# Altium schematic sheet Main.SchDoc
size A2; SheetNumber: 1; SheetTotal: 5
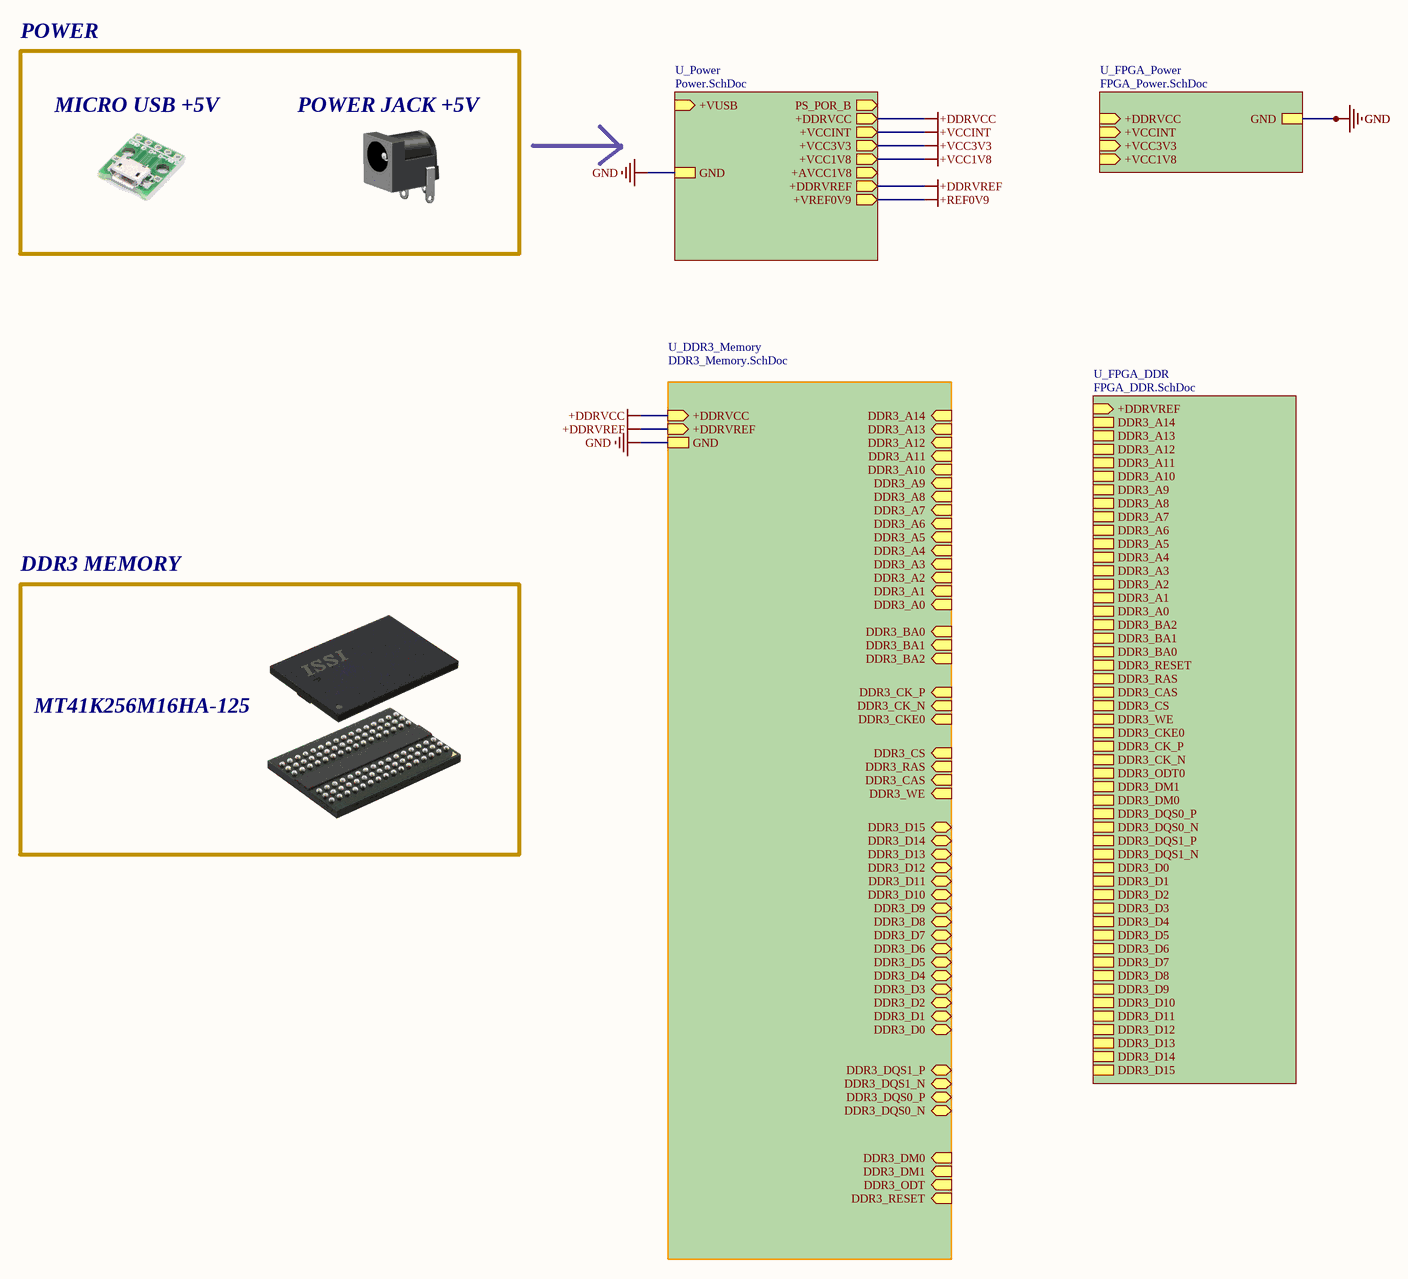
[diagram p0: Main.SchDoc]

## Sub-sheets
U_DDR3_Memory = DDR3_Memory.SchDoc: +DDRVCC (in), +DDRVREF (in), GND, DDR3_A14 (in), DDR3_A13 (in), DDR3_A12 (in), DDR3_A11 (in), DDR3_A10 (in), DDR3_A9 (in), DDR3_A8 (in), DDR3_A7 (in), DDR3_A6 (in), DDR3_A5 (in), DDR3_A4 (in), DDR3_A3 (in), DDR3_A2 (in), DDR3_A1 (in), DDR3_A0 (in), DDR3_BA0 (in), DDR3_BA1 (in), DDR3_BA2 (in), DDR3_CK_P (in), DDR3_CK_N (in), DDR3_CKE0 (in), DDR3_CS (in), DDR3_RAS (in), DDR3_CAS (in), DDR3_WE (in), DDR3_D15 (bidir), DDR3_D14 (bidir), DDR3_D13 (bidir), DDR3_D12 (bidir), DDR3_D11 (bidir), DDR3_D10 (bidir), DDR3_D9 (bidir), DDR3_D8 (bidir), DDR3_D7 (bidir), DDR3_D6 (bidir), DDR3_D5 (bidir), DDR3_D4 (bidir), DDR3_D3 (bidir), DDR3_D2 (bidir), DDR3_D1 (bidir), DDR3_D0 (bidir), DDR3_DQS1_P (bidir), DDR3_DQS1_N (bidir), DDR3_DQS0_P (bidir), DDR3_DQS0_N (bidir), DDR3_DM0 (in), DDR3_DM1 (in), DDR3_ODT (in), DDR3_RESET (in)
U_FPGA_DDR = FPGA_DDR.SchDoc: +DDRVREF (in), DDR3_A14, DDR3_A13, DDR3_A12, DDR3_A11, DDR3_A10, DDR3_A9, DDR3_A8, DDR3_A7, DDR3_A6, DDR3_A5, DDR3_A4, DDR3_A3, DDR3_A2, DDR3_A1, DDR3_A0, DDR3_BA2, DDR3_BA1, DDR3_BA0, DDR3_RESET, DDR3_RAS, DDR3_CAS, DDR3_CS, DDR3_WE, DDR3_CKE0, DDR3_CK_P, DDR3_CK_N, DDR3_ODT0, DDR3_DM1, DDR3_DM0, DDR3_DQS0_P, DDR3_DQS0_N, DDR3_DQS1_P, DDR3_DQS1_N, DDR3_D0, DDR3_D1, DDR3_D2, DDR3_D3, DDR3_D4, DDR3_D5, DDR3_D6, DDR3_D7, DDR3_D8, DDR3_D9, DDR3_D10, DDR3_D11, DDR3_D12, DDR3_D13, DDR3_D14, DDR3_D15
U_FPGA_Power = FPGA_Power.SchDoc: GND, +DDRVCC (in), +VCCINT (in), +VCC3V3 (in), +VCC1V8 (in)
U_Power = Power.SchDoc: PS_POR_B (out), +VUSB (in), +VCCINT (out), +VCC3V3 (out), +DDRVCC (out), +VCC1V8 (out), +AVCC1V8 (out), GND, +DDRVREF (out), +VREF0V9 (out)

## Nets
+DDRVCC: sheet U_Power/+DDRVCC, sheet U_DDR3_Memory/+DDRVCC
+DDRVREF: sheet U_Power/+DDRVREF, sheet U_DDR3_Memory/+DDRVREF
+REF0V9: sheet U_Power/+VREF0V9
+VCC1V8: sheet U_Power/+VCC1V8
+VCC3V3: sheet U_Power/+VCC3V3
+VCCINT: sheet U_Power/+VCCINT
GND: sheet U_FPGA_Power/GND, sheet U_Power/GND, sheet U_DDR3_Memory/GND

## Notes on the sheet
- POWER
- MICRO USB +5V
- POWER JACK +5V
- DDR3 MEMORY
- MT41K256M16HA-125